# Altium schematic sheet converter.SchDoc
size A4; DocumentNumber: 5; SheetNumber: 6; SheetTotal: 5
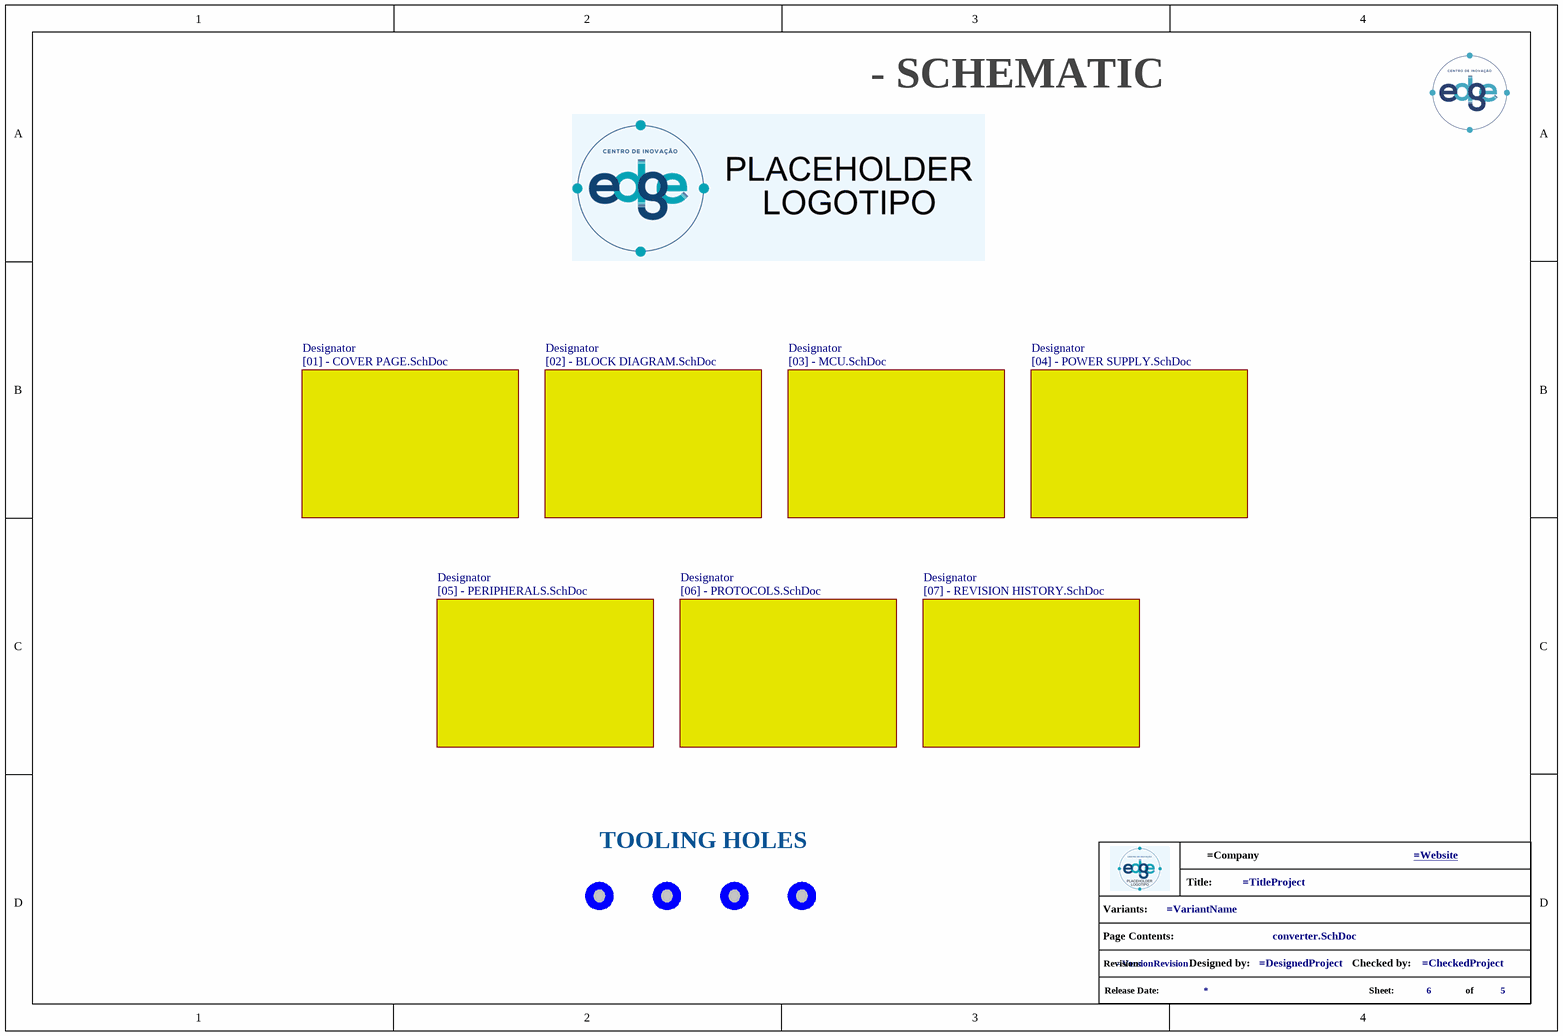
[diagram p0: converter.SchDoc]

## Parts
*?  info_project  (value not drawn)  (graphical)
TH1  Tooling Hole  [Tooling Hole]  (value not drawn)  (no BOM)
TH2  Tooling Hole  [Tooling Hole]  (value not drawn)  (no BOM)
TH3  Tooling Hole  [Tooling Hole]  (value not drawn)  (no BOM)
TH4  Tooling Hole  [Tooling Hole]  (value not drawn)  (no BOM)

## Sub-sheets
Designator = [02] - BLOCK DIAGRAM.SchDoc: no entries
Designator = [03] - MCU.SchDoc: no entries
Designator = [01] - COVER PAGE.SchDoc: no entries
Designator = [06] - PROTOCOLS.SchDoc: no entries
Designator = [04] - POWER SUPPLY.SchDoc: no entries
Designator = [05] - PERIPHERALS.SchDoc: no entries
Designator = [07] - REVISION HISTORY.SchDoc: no entries

## Notes on the sheet
- - SCHEMATIC
- TOOLING HOLES
- (in symbol info_project) Title:; Variants:; Page Contents:; Revision:; Designed by:; Checked by:; Release Date:; Sheet:; of

## Library data of the parts
TH1-TH4 = Tooling Hole: MECH - Tooling Holes